# Altium project SoM.PrjPcb (part 4 of 4)

## Sheet [18] Power_Management.SchDoc: Power Management
size B; DocumentNumber: I; Revision: 01; SheetNumber: 18; SheetTotal: 19
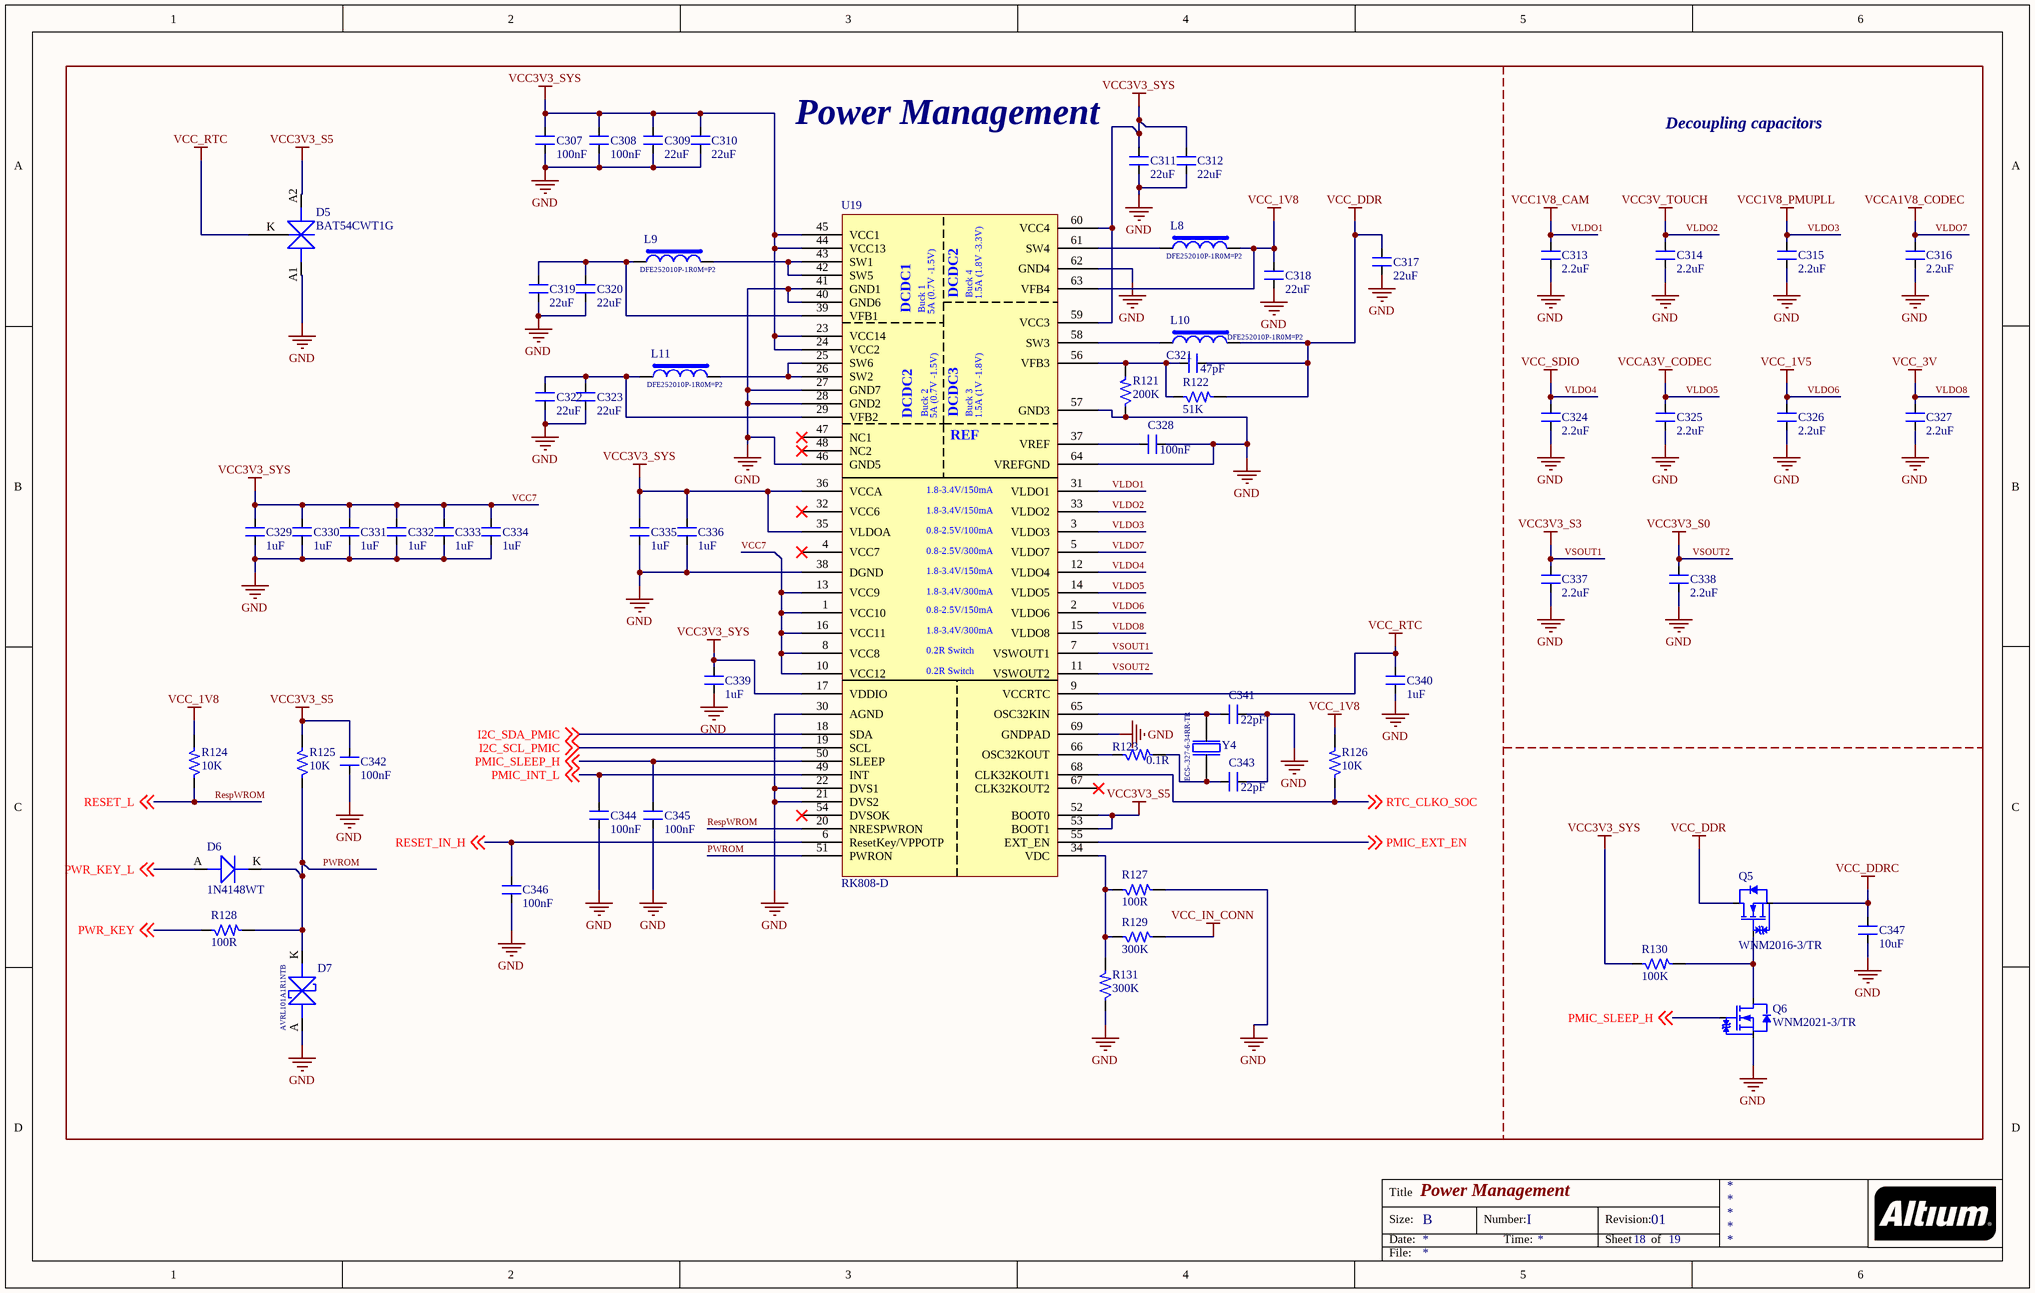
[diagram p17: [18] Power_Management.SchDoc]

### Parts
C307  100nF  [CAP_0402]
C308  100nF  [CAP_0402]
C309  22uF  [CAP_0603]
C310  22uF  [CAP_0603]
C311  22uF  [CAP_0603]
C312  22uF  [CAP_0603]
C313  2.2uF  [CAP_0402]
C314  2.2uF  [CAP_0402]
C315  2.2uF  [CAP_0402]
C316  2.2uF  [CAP_0402]
C317  22uF  [CAP_0603]
C318  22uF  [CAP_0603]
C319  22uF  [CAP_0603]
C320  22uF  [CAP_0603]
C321  47pF  [CAP_0402]
C322  22uF  [CAP_0603]
C323  22uF  [CAP_0603]
C324  2.2uF  [CAP_0402]
C325  2.2uF  [CAP_0402]
C326  2.2uF  [CAP_0402]
C327  2.2uF  [CAP_0402]
C328  100nF  [CAP_0402]
C329  1uF  [CAP_0402]
C330  1uF  [CAP_0402]
C331  1uF  [CAP_0402]
C332  1uF  [CAP_0402]
C333  1uF  [CAP_0402]
C334  1uF  [CAP_0402]
C335  1uF  [CAP_0402]
C336  1uF  [CAP_0402]
C337  2.2uF  [CAP_0402]
C338  2.2uF  [CAP_0402]
C339  1uF  [CAP_0402]
C340  1uF  [CAP_0402]
C341  22pF  [CAP_0402]
C342  100nF  [CAP_0402]
C343  22pF  [CAP_0402]
C344  100nF  [CAP_0402]
C345  100nF  [CAP_0402]
C346  100nF  [CAP_0402]
C347  10uF  [CAP_0402]
D5  BAT54CWT1G  [DIO_SOT-323-3]
D6  1N4148WT  [DIO_SOD523]
D7  AVRL101A1R1NTB  [DIO_0402_SMD]
L8  DFE252010P-1R0M=P2  [IND_1008]
L9  DFE252010P-1R0M=P2  [IND_1008]
L10  DFE252010P-1R0M=P2  [IND_1008]
L11  DFE252010P-1R0M=P2  [IND_1008]
Q5  WNM2016-3/TR  [SOT 23-3]
Q6  WNM2021-3/TR  [SOT-323-3]
R121  200K  [RES_0402]
R122  51K  [RES_0402]
R123  0.1R  [RES_0402]
R124  10K  [RES_0402]
R125  10K  [RES_0402]
R126  10K  [RES_0402]
R127  100R  [RES_0402]
R128  100R  [RES_0402]
R129  300K  [RES_0402]
R130  100K  [RES_0402]
R131  300K  [RES_0402]
U19  RK808-D  [QFN68_13.7_220.4X220.4_SMD]
Y4  ECS-.327-6-34RR-TR  [XTAL_ECS-.327-6-34RR-TR]

### Nets
GND: C307.1 C308.1 C309.1 C310.1 C311.1 C312.1 C313.1 C314.1 C315.1 C316.1 C317.1 C318.1 C319.1 C320.1 C322.1 C323.1 C324.1 C325.1 C326.1 C327.1 C328.2 C329.1 C330.1 C331.1 C332.1 C333.1 C334.1 C335.1 C336.1 C337.1 C338.1 C339.1 C340.1 C341.2 C342.1 C343.2 C344.1 C345.1 C346.1 C347.1 D5.A1 D7.A Q6.2(S) R121.1 R127.2 R131.1 U19.21(DVS2) U19.22(DVS1) U19.27(GND7) U19.28(GND2) U19.30(AGND) U19.38(DGND) U19.40(GND6) U19.41(GND1) U19.46(GND5) U19.57(GND3) U19.62(GND4) U19.64(VREFGND) U19.69(GNDPAD)
VCC3V3_S5: C342.2 D5.A2 R125.2 U19.52(BOOT0) U19.53(BOOT1)
VCC7: C307.2 C308.2 C309.2 C310.2 C311.2 C312.2 C329.2 C330.2 C331.2 C332.2 C333.2 C334.2 C335.2 C336.2 C339.2 R130.1 U19.1(VCC10) U19.8(VCC8) U19.10(VCC12) U19.13(VCC9) U19.16(VCC11) U19.17(VDDIO) U19.23(VCC14) U19.24(VCC2) U19.35(VLDOA) U19.36(VCCA) U19.44(VCC13) U19.45(VCC1) U19.59(VCC3) U19.60(VCC4)  [also labelled VCC3V3_SYS]
VCC_1V8: C318.2 L8.2 R124.2 R126.2 U19.63(VFB4)  [project net EDP_AVDD_1V8]
VCC_DDR: C317.2 C321.2 L10.2 Q5.3(D) R122.2
VCC_DDRC: C347.2 Q5.2(S)
VCC_IN_CONN: R129.2
VCC_RTC: C340.2 D5.K U19.9(VCCRTC)
VLDO1: C313.2 U19.31(VLDO1)  [also labelled VCC1V8_CAM]
VLDO2: C314.2 U19.33(VLDO2)  [also labelled VCC3V_TOUCH]
VLDO3: C315.2 U19.3(VLDO3)  [also labelled VCC1V8_PMUPLL]
VLDO4: C324.2 U19.12(VLDO4)  [also labelled VCC_SDIO]
VLDO5: C325.2 U19.14(VLDO5)  [also labelled VCCA3V_CODEC]
VLDO6: C326.2 U19.2(VLDO6)  [also labelled VCC_1V5]
VLDO7: C316.2 U19.5(VLDO7)  [also labelled VCCA1V8_CODEC]
VLDO8: C327.2 U19.15(VLDO8)  [also labelled VCC_3V]
VSOUT1: C337.2 U19.7(VSWOUT1)  [also labelled VCC3V3_S3]
VSOUT2: C338.2 U19.11(VSWOUT2)  [also labelled VCC3V3_S0]
I2C_SCL_PMIC: U19.19(SCL) ; off-sheet I2C_SCL_PMIC
I2C_SDA_PMIC: U19.18(SDA) ; off-sheet I2C_SDA_PMIC
PMIC_EXT_EN: U19.55(EXT_EN) ; off-sheet PMIC_EXT_EN
PMIC_INT_L: C344.2 U19.49(INT) ; off-sheet PMIC_INT_L
PMIC_SLEEP_H: C345.2 Q6.1(G) U19.50(SLEEP) ; off-sheet PMIC_SLEEP_H
PWR_KEY: R128.1 ; off-sheet PWR_KEY
PWR_KEY_L: D6.A(ANODE) ; off-sheet PWR_KEY_L
PWROM: D6.K(CATHODE) D7.K R125.1 R128.2 U19.51(PWRON)
RESET_IN_H: C346.2 U19.6(ResetKey/VPPOTP) ; off-sheet RESET_IN_H
RespWROM: R124.1 U19.20(NRESPWRON) ; off-sheet RESET_L  [also labelled RESET_L]
RTC_CLKO_SOC: R126.1 U19.68(CLK32KOUT1) ; off-sheet RTC_CLKO_SOC
NetC319_2: C319.2 C320.2 L9.1 U19.39(VFB1)
NetC321_1: C321.1 R121.2 R122.1 U19.56(VFB3)
NetC322_2: C322.2 C323.2 L11.1 U19.29(VFB2)
NetC328_1: C328.1 U19.37(VREF)
NetC341_1: C341.1 U19.65(OSC32KIN) Y4.2
NetC343_1: C343.1 R123.2 Y4.1
NetL8_1: L8.1 U19.61(SW4)
NetL9_2: L9.2 U19.42(SW5) U19.43(SW1)
NetL10_1: L10.1 U19.58(SW3)
NetL11_2: L11.2 U19.25(SW6) U19.26(SW2)
NetQ5_1: Q5.1(G) Q6.3(D) R130.2
NetR123_1: R123.1 U19.66(OSC32KOUT)
NetR127_1: R127.1 R129.1 R131.2 U19.34(VDC)

Not connected (* = marked no-connect by the designer): U19 4(VCC7)* 32(VCC6)* 47(NC1)* 48(NC2)* 54(DVSOK)* 67(CLK32KOUT2)*

### Notes on the sheet
- Power Management
- Decoupling capacitors
- Title
- Size:
- Date:
- B
- Number:
- Time:
- Revision:
- Sheet
- of
- File:
- (in symbol IC_RK808-D-QFN68) DCDC2; Buck 4; 1.5A (1.8V -3.3V); DCDC1; Buck 1; 5A (0.7V -1.5V); Buck 2; DCDC3; Buck 3; 1.5A (1V -1.8V); REF; 1.8-3.4V/150mA; 0.8-2.5V/100mA; 0.8-2.5V/300mA; 1.8-3.4V/300mA; 0.8-2.5V/150mA; 0.2R Switch

### Library data of the parts
C307 C308 = CAP_100nF-25V-10%-0402: 0.1µF ±10% 25V Ceramic Capacitor X7R 0402 (1005 Metric) /; Manufacturer: Walsin Technology Corporation; Manufacturer Part Number: 0402B104K250CT; Case/Package: 0402; Supplier-1: Digikey
C309-C312 C317-C320 C322 C323 = CAP_22uF-10V-20%-0603: 22µF ±20% 10V Ceramic Capacitor X5R 0603 (1608 Metric) /; Manufacturer: Murata Electronics; Manufacturer Part Number: GRM188R61A226ME15D; Case/Package: 0603; Supplier-1: Digikey
C313-C316 C324-C327 C337 C338 = CAP_2.2uF-10V-10%-0402: 2.2µF ±10% 10V Ceramic Capacitor X5R 0402 (1005 Metric) /; Manufacturer: Murata Electronics; Manufacturer Part Number: GRM155R61A225KE95D; Case/Package: 0402; Supplier-1: Digikey
C321 = CAP_47pF-10V-10%-0402: 47pF ±10% 10V Ceramic Capacitor C0G, NP0 0402 (1005 Metric) /; Manufacturer: KEMET; Manufacturer Part Number: C0402C470K8GAC7867; Case/Package: 0402; Supplier-1: Supplier-1
C328 C342 C344-C346 = CAP_100nF-10V-10%-0402: 0.1µF ±10% 10V Ceramic Capacitor X7R 0402 (1005 Metric) /; Manufacturer: Yageo; Manufacturer Part Number: CC0402KRX7R6BB104; Case/Package: 0402; Supplier-1: Digikey
C329-C336 C339 = CAP_1uF-10V-10%-0402: 1µF ±10% 10V Ceramic Capacitor X6S 0402 (1005 Metric) /; Manufacturer: Murata Electronics; Manufacturer Part Number: GRT155C81A105KE01D; Case/Package: 0402; Supplier-1: Digikey
C340 = CAP_1uF-16V-10%-0402: 1µF ±10% 16V Ceramic Capacitor X5R 0402 (1005 Metric) /; Manufacturer: Knowles Novacap; Manufacturer Part Number: 0402BW105K160YT; Case/Package: 0402; Supplier-1: Digikey
C341 C343 = CAP_22pF-10V-10%-0402: 22pF ±10% 10V Ceramic Capacitor C0G, NP0 0402 (1005 Metric) /; Manufacturer: KEMET; Manufacturer Part Number: C0402C220K8GACTU; Case/Package: 0402; Supplier-1: Digikey
C347 = CAP_10uF-10V-20%-0402: 10µF ±20% 10V Ceramic Capacitor X5R 0402 (1005 Metric) /; Manufacturer Part Number: CL05A106MP5NUNC; Manufacturer: Samsung Electro-Mechanics; Case/Package: 0402; Supplier-1: Digikey
D5 = DIO-S-A_30V-200mA-SOT-323: Diode Array 1 Pair Common Cathode Schottky 30V 200mA (DC) Surface Mount SC-70, SOT-323; Manufacturer: ON Semiconductor; Manufacturer Part Number: BAT54CWT1G; Case/Package: SOT323; Supplier-1: Digikey
D6 = DIO_75V-200mA-SOD-523F: Diode Standard 100V 300mA (DC) Surface Mount SOD-123; Manufacturer: FAIRCHILD; Manufacturer Part Number: 1N4148WT; Case/Package: SOD123; Supplier-1: SIRICOM
D7 = DIO-T_10V-39V-0402: 39V Varistor 1 Circuit Surface Mount, MLCV 0402 (1005 Metric); Manufacturer: TDK Corporation; Manufacturer Part Number: AVRL101A1R1NTB; Supplier-1: Digikey; Case/Package: 0402
L8-L11 = IND_1uH-3.8A-20%-1008: 1µH Shielded Wirewound Inductor 3.8A 54mOhm Max 1008 (2520 Metric) /; Manufacturer: Murata Electronics; Manufacturer Part Number: DFE252010P-1R0M=P2; Case/Package: 1008; Supplier-1: Digikey
Q5 = MOSFET-N_20V-2.9A-SOT-23: N Channel 20V 2.9A 1V @ 250uA 47mΩ @ 3.6A,4.5V 700mW SOT-23(SOT-23-3) MOSFET RoHS /; Manufacturer: WILLSEMI(Will Semicon); Manufacturer Part Number: WNM2016-3/TR; Case/Package: SOT-23(SOT-23-3); Supplier-1: LCSC
Q6 = MOSFET-N_20V-820mA-SOT-323: N Channel 20V 820mA 850mV @ 250uA 310mΩ @ 550mA,4.5V 310mW SOT-323(SC-70) MOSFET RoHS /; Manufacturer: WILLSEMI(Will Semicon); Manufacturer Part Number: WNM2021-3/TR; Case/Package: SOT-323(SC-70); Supplier-1: LCSC
R121 = RES_200K-0.1W-1%-0402: 200 kOhms ±1% 0.1W, 1/10W Chip Resistor 0402 (1005 Metric) Automotive AEC-Q200 Thick Film /; Manufacturer: Panasonic Electronic Components; Manufacturer Part number: ERJ-2RKF2003X; Case/Package: 0402; Supplier-1: Digikey
R122 = RES_51K-0.1W-1%-0402: 51 kOhms ±1% 0.1W, 1/10W Chip Resistor 0402 (1005 Metric) Automotive AEC-Q200 Thick Film /; Manufacturer: Panasonic Electronic Components; Manufacturer Part Number: ERJ-2RKF5102X; Case/Package: 0402; Supplier-1: Digikey
R123 = RES_0.1R-0.1W-1%-0402: 100 mOhms ±1% 0.1W, 1/10W Chip Resistor 0402 (1005 Metric) Current Sense, Moisture Resistant Thick Film /; Manufacturer: Samsung Electro-Mechanics; Manufacturer Part Number: RUT1005FR100CS; Casse/Package: 0402; Supplier-1: Digikey
R124-R126 = RES_10K-0.1W-1%-0402: 10 kOhms ±1% 0.1W, 1/10W Chip Resistor 0402 (1005 Metric) Anti-Sulfur Thin Film /; Manufacturer: Vishay Beyschlag/Draloric/BC Components; Manufacturer Part Number: MCS04020C1002FE000; Case/Package: 0402; Supplier-1: Digikey
R127 R128 = RES_100R-0.1W-1%-0402: 100 Ohms ±1% 0.1W, 1/10W Chip Resistor 0402 (1005 Metric) Automotive AEC-Q200, Moisture Resistant Thick Film /; Manufacturer: KOA Speer Electronics, Inc.; Manufacturer Part Number: RK73H1ETTP1000F; Case/Package: 0402; Supplier-1: Digikey
R129 R131 = RES_300K-0.1W-1%-0402: 300 kOhms ±1% 0.1W, 1/10W Chip Resistor 0402 (1005 Metric) Automotive AEC-Q200 Thick Film /; Manufacturer: Panasonic Electronic Components; Manufacturer Part Number: ERJ-2RKF3003X; Case/Package: 0402; Supplier-1: Digikey
R130 = RES_100K-0.1W-1%-0402: 100 kOhms ±1% 0.1W, 1/10W Chip Resistor 0402 (1005 Metric) Anti-Sulfur Thin Film /; Manufacturer: Vishay Beyschlag/Draloric/BC Components; Manufacturer Part Number: MCS04020C1003FE000; Case/Package: 0402; Supplier-1: Digikey
U19 = IC_RK808-D-QFN68: The RK808 is a complete power supply solution for Portable systems.; Manufacturer: Rockchip; Manufacturer Part Number: RK808-D; Case/Package: QFN68; Supplier-1: Rockchip
Y4 = XTAL_32.768Khz-22pF-SMD: 32.768kHz ±20ppm Crystal 12pF 80 kOhms 2-SMD, No Lead /; Manufacturer: Ecliptek; Manufacturer Part Number: ECS-.327-6-34RR-TR; Case/Package: 0603; Supplier-1: Digikey

## Sheet [19] RAM Memory module.SchDoc: RAM Memory
size B; DocumentNumber: I; Revision: 01; SheetNumber: 19; SheetTotal: 19
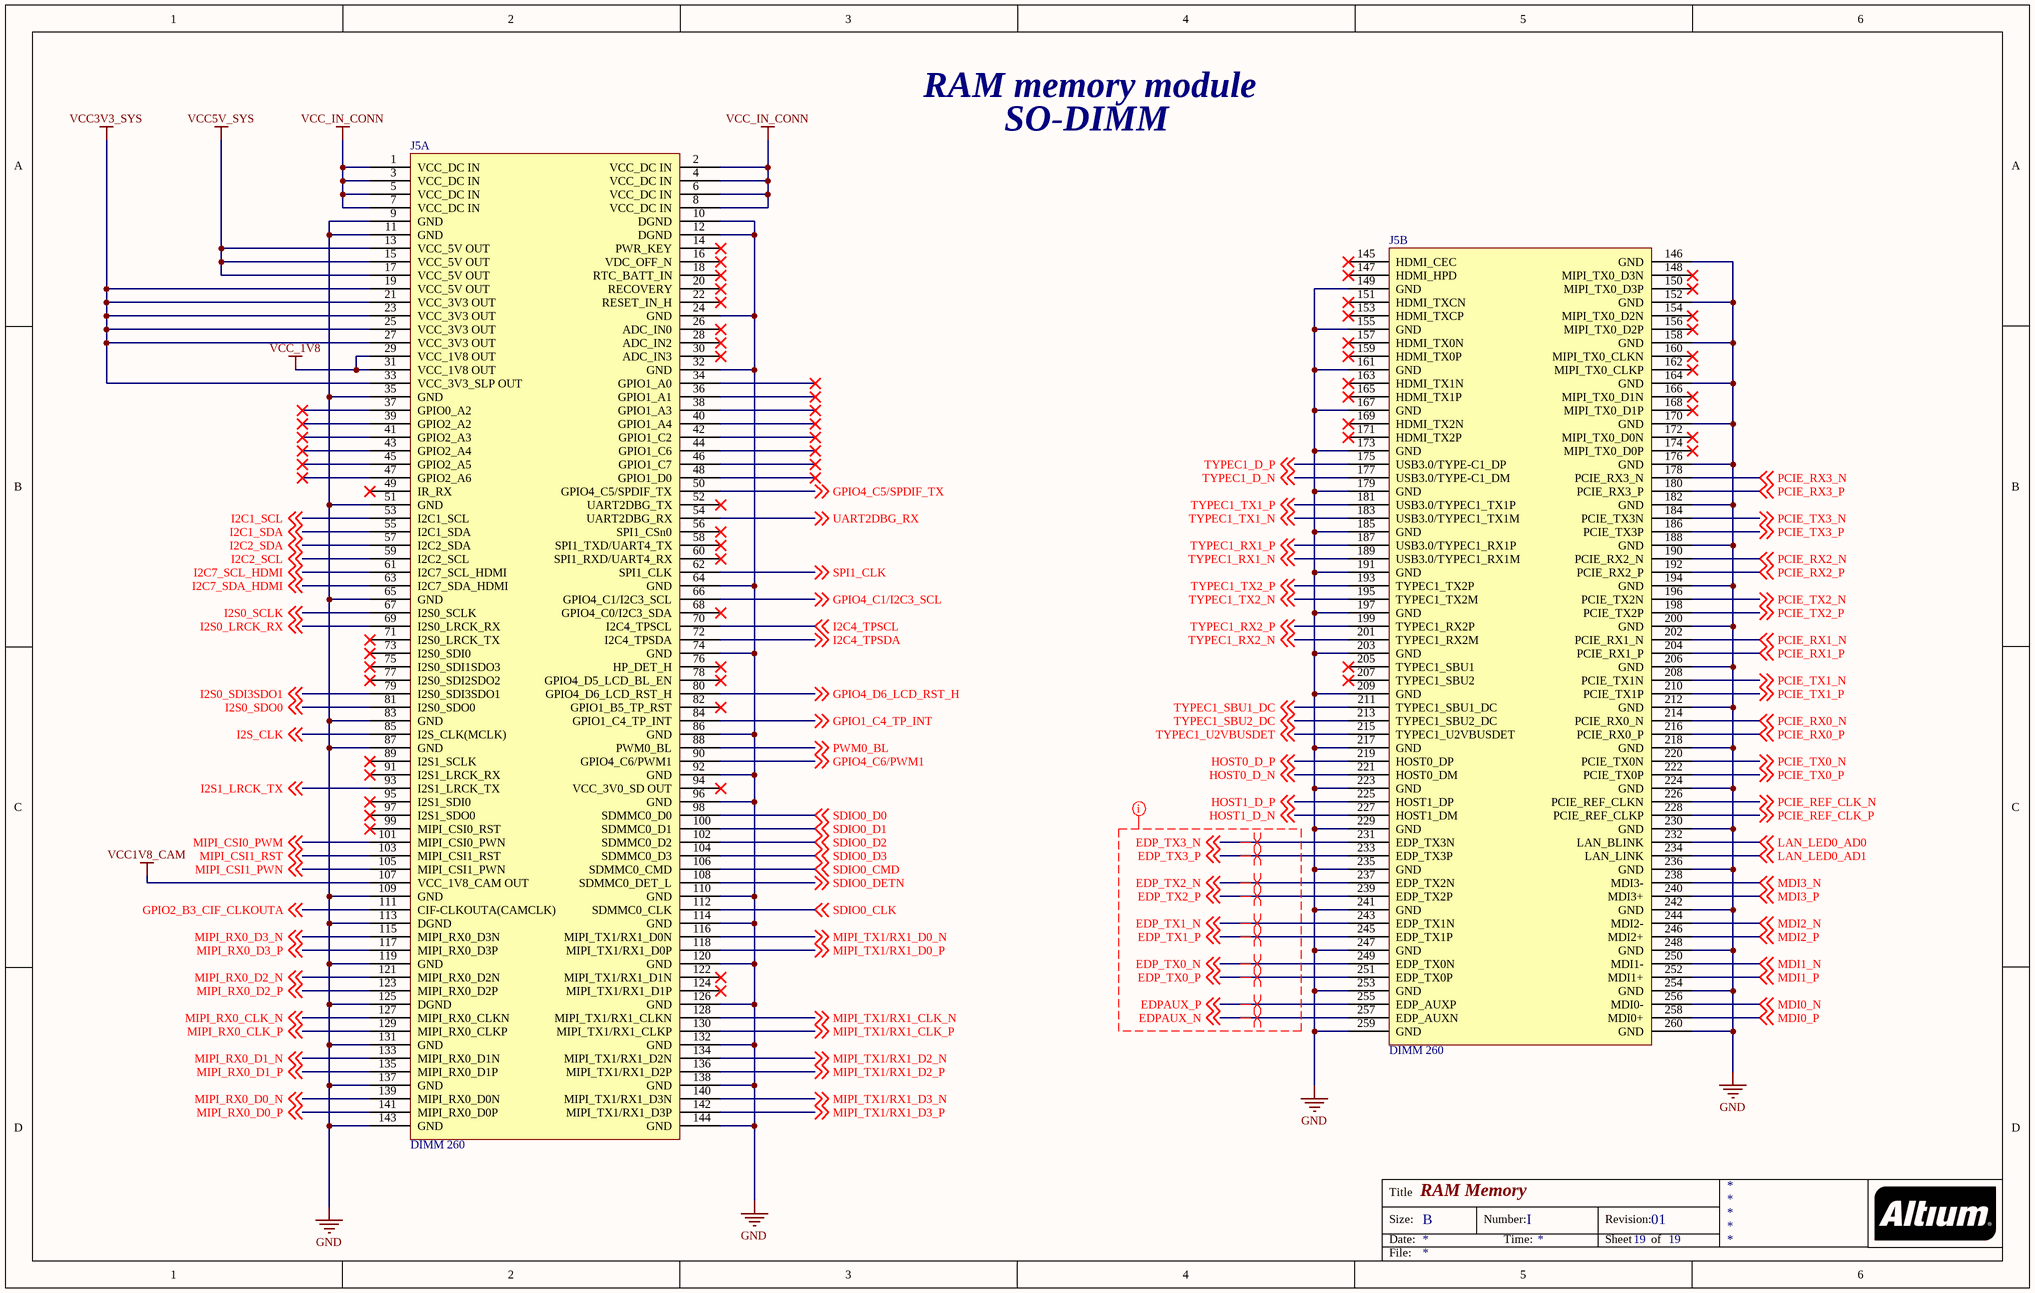
[diagram p18: [19] RAM Memory module.SchDoc]

### Parts
J5  DIMM 260  [DIMM260_DDR4]  (parts A,B of 2)

### Nets
GND: J5.9(GND) J5.10(DGND) J5.11(GND) J5.12(DGND) J5.24(GND) J5.32(GND) J5.35(GND) J5.51(GND) J5.64(GND) J5.65(GND) J5.74(GND) J5.83(GND) J5.86(GND) J5.87(GND) J5.92(GND) J5.96(GND) J5.109(GND) J5.110(GND) J5.113(DGND) J5.114(GND) J5.119(GND) J5.120(GND) J5.125(DGND) J5.126(GND) J5.131(GND) J5.132(GND) J5.137(GND) J5.138(GND) J5.143(GND) J5.144(GND) J5.146(GND) J5.149(GND) J5.152(GND) J5.155(GND) J5.158(GND) J5.161(GND) J5.164(GND) J5.167(GND) J5.170(GND) J5.173(GND) J5.176(GND) J5.179(GND) J5.182(GND) J5.185(GND) J5.188(GND) J5.191(GND) J5.194(GND) J5.197(GND) J5.200(GND) J5.203(GND) J5.206(GND) J5.209(GND) J5.212(GND) J5.217(GND) J5.218(GND) J5.223(GND) J5.224(GND) J5.229(GND) J5.230(GND) J5.235(GND) J5.236(GND) J5.241(GND) J5.242(GND) J5.247(GND) J5.248(GND) J5.253(GND) J5.254(GND) J5.259(GND) J5.260(GND)
VCC1V8_CAM: J5.107(VCC_1V8_CAM_OUT)  [project net VLDO1]
VCC3V3_SYS: J5.19(VCC_5V_OUT) J5.21(VCC_3V3_OUT) J5.23(VCC_3V3_OUT) J5.25(VCC_3V3_OUT) J5.27(VCC_3V3_OUT) J5.33(VCC_3V3_SLP_OUT)  [project net VCC7]
VCC5V_SYS: J5.13(VCC_5V_OUT) J5.15(VCC_5V_OUT) J5.17(VCC_5V_OUT)
VCC_1V8: J5.29(VCC_1V8_OUT) J5.31(VCC_1V8_OUT)  [project net EDP_AVDD_1V8]
VCC_IN_CONN: J5.1(VCC_DC_IN) J5.2(VCC_DC_IN) J5.3(VCC_DC_IN) J5.4(VCC_DC_IN) J5.5(VCC_DC_IN) J5.6(VCC_DC_IN) J5.7(VCC_DC_IN) J5.8(VCC_DC_IN)
EDP_TX0_N: J5.249(EDP_TX0N) ; off-sheet EDP_TX0_N
EDP_TX0_P: J5.251(EDP_TX0P) ; off-sheet EDP_TX0_P
EDP_TX1_N: J5.243(EDP_TX1N) ; off-sheet EDP_TX1_N
EDP_TX1_P: J5.245(EDP_TX1P) ; off-sheet EDP_TX1_P
EDP_TX2_N: J5.237(EDP_TX2N) ; off-sheet EDP_TX2_N
EDP_TX2_P: J5.239(EDP_TX2P) ; off-sheet EDP_TX2_P
EDP_TX3_N: J5.231(EDP_TX3N) ; off-sheet EDP_TX3_N
EDP_TX3_P: J5.233(EDP_TX3P) ; off-sheet EDP_TX3_P
EDPAUX_N: J5.257(EDP_AUXN) ; off-sheet EDPAUX_N
EDPAUX_P: J5.255(EDP_AUXP) ; off-sheet EDPAUX_P
GPIO1_C4_TP_INT: J5.84(GPIO1_C4_TP_INT) ; off-sheet GPIO1_C4_TP_INT
GPIO2_B3_CIF_CLKOUTA: J5.111(CIF-CLKOUTA(CAMCLK)) ; off-sheet GPIO2_B3_CIF_CLKOUTA
GPIO4_C1/I2C3_SCL: J5.66(GPIO4_C1/I2C3_SCL) ; off-sheet GPIO4_C1/I2C3_SCL
GPIO4_C5/SPDIF_TX: J5.50(GPIO4_C5/SPDIF_TX) ; off-sheet GPIO4_C5/SPDIF_TX
GPIO4_C6/PWM1: J5.90(GPIO4_C6/PWM1) ; off-sheet GPIO4_C6/PWM1
GPIO4_D6_LCD_RST_H: J5.80(GPIO4_D6_LCD_RST_H) ; off-sheet GPIO4_D6_LCD_RST_H
HOST0_D_N: J5.221(HOST0_DM) ; off-sheet HOST0_D_N
HOST0_D_P: J5.219(HOST0_DP) ; off-sheet HOST0_D_P
HOST1_D_N: J5.227(HOST1_DM) ; off-sheet HOST1_D_N
HOST1_D_P: J5.225(HOST1_DP) ; off-sheet HOST1_D_P
I2C1_SCL: J5.53(I2C1_SCL) ; off-sheet I2C1_SCL
I2C1_SDA: J5.55(I2C1_SDA) ; off-sheet I2C1_SDA
I2C2_SCL: J5.59(I2C2_SCL) ; off-sheet I2C2_SCL
I2C2_SDA: J5.57(I2C2_SDA) ; off-sheet I2C2_SDA
I2C4_TPSCL: J5.70(I2C4_TPSCL) ; off-sheet I2C4_TPSCL
I2C4_TPSDA: J5.72(I2C4_TPSDA) ; off-sheet I2C4_TPSDA
I2C7_SCL_HDMI: J5.61(I2C7_SCL_HDMI) ; off-sheet I2C7_SCL_HDMI
I2C7_SDA_HDMI: J5.63(I2C7_SDA_HDMI) ; off-sheet I2C7_SDA_HDMI
I2S0_LRCK_RX: J5.69(I2S0_LRCK_RX) ; off-sheet I2S0_LRCK_RX
I2S0_SCLK: J5.67(I2S0_SCLK) ; off-sheet I2S0_SCLK
I2S0_SDI3SDO1: J5.79(I2S0_SDI3SDO1) ; off-sheet I2S0_SDI3SDO1
I2S0_SDO0: J5.81(I2S0_SDO0) ; off-sheet I2S0_SDO0
I2S1_LRCK_TX: J5.93(I2S1_LRCK_TX) ; off-sheet I2S1_LRCK_TX
I2S_CLK: J5.85(I2S_CLK(MCLK)) ; off-sheet I2S_CLK
LAN_LED0_AD0: J5.232(LAN_BLINK) ; off-sheet LAN_LED0_AD0
LAN_LED0_AD1: J5.234(LAN_LINK) ; off-sheet LAN_LED0_AD1
MDI0_N: J5.256(MDI0-) ; off-sheet MDI0_N
MDI0_P: J5.258(MDI0+) ; off-sheet MDI0_P
MDI1_N: J5.250(MDI1-) ; off-sheet MDI1_N
MDI1_P: J5.252(MDI1+) ; off-sheet MDI1_P
MDI2_N: J5.244(MDI2-) ; off-sheet MDI2_N
MDI2_P: J5.246(MDI2+) ; off-sheet MDI2_P
MDI3_N: J5.238(MDI3-) ; off-sheet MDI3_N
MDI3_P: J5.240(MDI3+) ; off-sheet MDI3_P
MIPI_CSI0_PWM: J5.101(MIPI_CSI0_PWN) ; off-sheet MIPI_CSI0_PWM
MIPI_CSI1_PWN: J5.105(MIPI_CSI1_PWN) ; off-sheet MIPI_CSI1_PWN
MIPI_CSI1_RST: J5.103(MIPI_CSI1_RST) ; off-sheet MIPI_CSI1_RST
MIPI_RX0_CLK_N: J5.127(MIPI_RX0_CLKN) ; off-sheet MIPI_RX0_CLK_N
MIPI_RX0_CLK_P: J5.129(MIPI_RX0_CLKP) ; off-sheet MIPI_RX0_CLK_P
MIPI_RX0_D0_N: J5.139(MIPI_RX0_D0N) ; off-sheet MIPI_RX0_D0_N
MIPI_RX0_D0_P: J5.141(MIPI_RX0_D0P) ; off-sheet MIPI_RX0_D0_P
MIPI_RX0_D1_N: J5.133(MIPI_RX0_D1N) ; off-sheet MIPI_RX0_D1_N
MIPI_RX0_D1_P: J5.135(MIPI_RX0_D1P) ; off-sheet MIPI_RX0_D1_P
MIPI_RX0_D2_N: J5.121(MIPI_RX0_D2N) ; off-sheet MIPI_RX0_D2_N
MIPI_RX0_D2_P: J5.123(MIPI_RX0_D2P) ; off-sheet MIPI_RX0_D2_P
MIPI_RX0_D3_N: J5.115(MIPI_RX0_D3N) ; off-sheet MIPI_RX0_D3_N
MIPI_RX0_D3_P: J5.117(MIPI_RX0_D3P) ; off-sheet MIPI_RX0_D3_P
MIPI_TX1/RX1_CLK_N: J5.128(MIPI_TX1/RX1_CLKN) ; off-sheet MIPI_TX1/RX1_CLK_N
MIPI_TX1/RX1_CLK_P: J5.130(MIPI_TX1/RX1_CLKP) ; off-sheet MIPI_TX1/RX1_CLK_P
MIPI_TX1/RX1_D0_N: J5.116(MIPI_TX1/RX1_D0N) ; off-sheet MIPI_TX1/RX1_D0_N
MIPI_TX1/RX1_D0_P: J5.118(MIPI_TX1/RX1_D0P) ; off-sheet MIPI_TX1/RX1_D0_P
MIPI_TX1/RX1_D2_N: J5.134(MIPI_TX1/RX1_D2N) ; off-sheet MIPI_TX1/RX1_D2_N
MIPI_TX1/RX1_D2_P: J5.136(MIPI_TX1/RX1_D2P) ; off-sheet MIPI_TX1/RX1_D2_P
MIPI_TX1/RX1_D3_N: J5.140(MIPI_TX1/RX1_D3N) ; off-sheet MIPI_TX1/RX1_D3_N
MIPI_TX1/RX1_D3_P: J5.142(MIPI_TX1/RX1_D3P) ; off-sheet MIPI_TX1/RX1_D3_P
PCIE_REF_CLK_N: J5.226(PCIE_REF_CLKN) ; off-sheet PCIE_REF_CLK_N
PCIE_REF_CLK_P: J5.228(PCIE_REF_CLKP) ; off-sheet PCIE_REF_CLK_P
PCIE_RX0_N: J5.214(PCIE_RX0_N) ; off-sheet PCIE_RX0_N
PCIE_RX0_P: J5.216(PCIE_RX0_P) ; off-sheet PCIE_RX0_P
PCIE_RX1_N: J5.202(PCIE_RX1_N) ; off-sheet PCIE_RX1_N
PCIE_RX1_P: J5.204(PCIE_RX1_P) ; off-sheet PCIE_RX1_P
PCIE_RX2_N: J5.190(PCIE_RX2_N) ; off-sheet PCIE_RX2_N
PCIE_RX2_P: J5.192(PCIE_RX2_P) ; off-sheet PCIE_RX2_P
PCIE_RX3_N: J5.178(PCIE_RX3_N) ; off-sheet PCIE_RX3_N
PCIE_RX3_P: J5.180(PCIE_RX3_P) ; off-sheet PCIE_RX3_P
PCIE_TX0_N: J5.220(PCIE_TX0N) ; off-sheet PCIE_TX0_N
PCIE_TX0_P: J5.222(PCIE_TX0P) ; off-sheet PCIE_TX0_P
PCIE_TX1_N: J5.208(PCIE_TX1N) ; off-sheet PCIE_TX1_N
PCIE_TX1_P: J5.210(PCIE_TX1P) ; off-sheet PCIE_TX1_P
PCIE_TX2_N: J5.196(PCIE_TX2N) ; off-sheet PCIE_TX2_N
PCIE_TX2_P: J5.198(PCIE_TX2P) ; off-sheet PCIE_TX2_P
PCIE_TX3_N: J5.184(PCIE_TX3N) ; off-sheet PCIE_TX3_N
PCIE_TX3_P: J5.186(PCIE_TX3P) ; off-sheet PCIE_TX3_P
PWM0_BL: J5.88(PWM0_BL) ; off-sheet PWM0_BL
SDIO0_CLK: J5.112(SDMMC0_CLK) ; off-sheet SDIO0_CLK
SDIO0_CMD: J5.106(SDMMC0_CMD) ; off-sheet SDIO0_CMD
SDIO0_D0: J5.98(SDMMC0_D0) ; off-sheet SDIO0_D0
SDIO0_D1: J5.100(SDMMC0_D1) ; off-sheet SDIO0_D1
SDIO0_D2: J5.102(SDMMC0_D2) ; off-sheet SDIO0_D2
SDIO0_D3: J5.104(SDMMC0_D3) ; off-sheet SDIO0_D3
SDIO0_DETN: J5.108(SDMMC0_DET_L) ; off-sheet SDIO0_DETN
SPI1_CLK: J5.62(SPI1_CLK) ; off-sheet SPI1_CLK
TYPEC1_D_N: J5.177(USB3.0/TYPE-C1_DM) ; off-sheet TYPEC1_D_N
TYPEC1_D_P: J5.175(USB3.0/TYPE-C1_DP) ; off-sheet TYPEC1_D_P
TYPEC1_RX1_N: J5.189(USB3.0/TYPEC1_RX1M) ; off-sheet TYPEC1_RX1_N
TYPEC1_RX1_P: J5.187(USB3.0/TYPEC1_RX1P) ; off-sheet TYPEC1_RX1_P
TYPEC1_RX2_N: J5.201(TYPEC1_RX2M) ; off-sheet TYPEC1_RX2_N
TYPEC1_RX2_P: J5.199(TYPEC1_RX2P) ; off-sheet TYPEC1_RX2_P
TYPEC1_SBU1_DC: J5.211(TYPEC1_SBU1_DC) ; off-sheet TYPEC1_SBU1_DC
TYPEC1_SBU2_DC: J5.213(TYPEC1_SBU2_DC) ; off-sheet TYPEC1_SBU2_DC
TYPEC1_TX1_N: J5.183(USB3.0/TYPEC1_TX1M) ; off-sheet TYPEC1_TX1_N
TYPEC1_TX1_P: J5.181(USB3.0/TYPEC1_TX1P) ; off-sheet TYPEC1_TX1_P
TYPEC1_TX2_N: J5.195(TYPEC1_TX2M) ; off-sheet TYPEC1_TX2_N
TYPEC1_TX2_P: J5.193(TYPEC1_TX2P) ; off-sheet TYPEC1_TX2_P
TYPEC1_U2VBUSDET: J5.215(TYPEC1_U2VBUSDET) ; off-sheet TYPEC1_U2VBUSDET
UART2DBG_RX: J5.54(UART2DBG_RX) ; off-sheet UART2DBG_RX

Not connected (* = marked no-connect by the designer): J5 14(PWR_KEY)* 16(VDC_OFF_N)* 18(RTC_BATT_IN)* 20(RECOVERY)* 22(RESET_IN_H)* 26(ADC_IN0)* 28(ADC_IN2)* 30(ADC_IN3)* 34(GPIO1_A0)* 36(GPIO1_A1)* 37(GPIO0_A2)* 38(GPIO1_A3)* 39(GPIO2_A2)* 40(GPIO1_A4)* 41(GPIO2_A3)* 42(GPIO1_C2)* 43(GPIO2_A4)* 44(GPIO1_C6)* 45(GPIO2_A5)* 46(GPIO1_C7)* 47(GPIO2_A6)* 48(GPIO1_D0)* 49(IR_RX)* 52(UART2DBG_TX)* 56(SPI1_CSn0)* 58(SPI1_TXD/UART4_TX)* 60(SPI1_RXD/UART4_RX)* 68(GPIO4_C0/I2C3_SDA)* 71(I2S0_LRCK_TX)* 73(I2S0_SDI0)* 75(I2S0_SDI1SDO3)* 76(HP_DET_H)* 77(I2S0_SDI2SDO2)* 78(GPIO4_D5_LCD_BL_EN)* 82(GPIO1_B5_TP_RST)* 89(I2S1_SCLK)* 91(I2S1_LRCK_RX)* 94(VCC_3V0_SD_OUT)* 95(I2S1_SDI0)* 97(I2S1_SDO0)* 99(MIPI_CSI0_RST)* 122(MIPI_TX1/RX1_D1N)* 124(MIPI_TX1/RX1_D1P)* 145(HDMI_CEC)* 147(HDMI_HPD)* 148(MIPI_TX0_D3N)* 150(MIPI_TX0_D3P)* 151(HDMI_TXCN)* 153(HDMI_TXCP)* 154(MIPI_TX0_D2N)* 156(MIPI_TX0_D2P)* 157(HDMI_TX0N)* 159(HDMI_TX0P)* 160(MIPI_TX0_CLKN)* 162(MIPI_TX0_CLKP)* 163(HDMI_TX1N)* 165(HDMI_TX1P)* 166(MIPI_TX0_D1N)* 168(MIPI_TX0_D1P)* 169(HDMI_TX2N)* 171(HDMI_TX2P)* 172(MIPI_TX0_D0N)* 174(MIPI_TX0_D0P)* 205(TYPEC1_SBU1)* 207(TYPEC1_SBU2)*

### Layout directives
mark named 100_OHM_DIFF: EDP_TX0_N, EDP_TX0_P, EDP_TX1_N, EDP_TX1_P, EDP_TX2_N, EDP_TX2_P, EDP_TX3_N, EDP_TX3_P, EDPAUX_N, EDPAUX_P
differential pair; differential pair class 100_OHM_DIFF: EDP_TX0_N, EDP_TX0_P, EDP_TX1_N, EDP_TX1_P, EDP_TX2_N, EDP_TX2_P, EDP_TX3_N, EDP_TX3_P, EDPAUX_N, EDPAUX_P

### Notes on the sheet
- RAM memory module
- SO-DIMM
- Title
- Size:
- Date:
- B
- Number:
- Time:
- Revision:
- Sheet
- of
- File:

### Library data of the parts
J5 = CON-DIMM_260-SMD: Dimm 260 pin smd plating on pcb; Manufacturer: NA; Manufacturer Part Number: NA; Case/Package: NA; Supplier-1: NA

## Nets that join several sheets
EDP_AVDD_0V9: [2] RK3399_SDRAM (FB3.2), [3] RK3399_PMU (FB8.1 U8.T24), [4] RK3399_EMMC_ADC_PCIE (C187.2 C192.2 U8.L24 U8.W24), [5] RK3399_EDP_CSI_HDMI (6 pins), [6] RK3399_USB2_USIC (8 pins), [17] Voltage_Regulators (C305.2 L7.2 R112.2)
EDP_AVDD_1V8: [11] FlashMemory (9 pins), [3] RK3399_PMU (FB7.2 FB9.1), [4] RK3399_EMMC_ADC_PCIE (5 pins), [5] RK3399_EDP_CSI_HDMI (8 pins), [6] RK3399_USB2_USIC (6 pins), [7] RK3399_MIPI-CSI_I2C (12 pins), [8] RK3399_SDIO_SPI_GPIOs (C225.2 C227.2 U8.AB8 U8.J22), [17] Voltage_Regulators (R105.2 R106.2 R109.1), [18] Power_Management (5 pins), [19] RAM Memory module (J5.29 J5.31)
GND: [9] LPDDR4_SDRAM1 (100 pins), [10] LPDDR_SDRAM2 (104 pins), [11] FlashMemory (18 pins), [12] WIFI_Module (29 pins), [1] RK3399_PowerPins (268 pins), [2] RK3399_SDRAM (19 pins), [3] RK3399_PMU (14 pins), [4] RK3399_EMMC_ADC_PCIE (9 pins), [5] RK3399_EDP_CSI_HDMI (18 pins), [6] RK3399_USB2_USIC (16 pins), [7] RK3399_MIPI-CSI_I2C (6 pins), [8] RK3399_SDIO_SPI_GPIOs (11 pins), [13] TYPEC0_PROG (25 pins), [14] Ethernet (29 pins), [15] PushButtons (Q1.2 SW2.1 SW3.1), [16] SPI_TYPEC_PWR (34 pins), [17] Voltage_Regulators (45 pins), [18] Power_Management (59 pins), [19] RAM Memory module (69 pins)
VCC3V3_S5: [16] SPI_TYPEC_PWR (C281.2 C282.2 C283.2 U14.5), [18] Power_Management (5 pins)
VCC5V_SYS: [12] WIFI_Module (C96.1 U4.1 U4.6), [13] TYPEC0_PROG (5 pins), [15] PushButtons (R92.2), [16] SPI_TYPEC_PWR (8 pins), [19] RAM Memory module (J5.13 J5.15 J5.17)
VCC7: [12] WIFI_Module (5 pins), [3] RK3399_PMU (C185.2 U9.1), [13] TYPEC0_PROG (C234.2 U10.4), [15] PushButtons (SW1.1), [16] SPI_TYPEC_PWR (5 pins), [17] Voltage_Regulators (21 pins), [18] Power_Management (30 pins), [19] RAM Memory module (6 pins)
VCC_DDR: [9] LPDDR4_SDRAM1 (43 pins), [10] LPDDR_SDRAM2 (43 pins), [2] RK3399_SDRAM (44 pins), [18] Power_Management (5 pins)
VCC_DDRC: [9] LPDDR4_SDRAM1 (41 pins), [10] LPDDR_SDRAM2 (41 pins), [18] Power_Management (C347.2 Q5.2)
VCC_IN_CONN: [16] SPI_TYPEC_PWR (10 pins), [18] Power_Management (R129.2), [19] RAM Memory module (8 pins)
VLDO1: [18] Power_Management (C313.2 U19.31), [19] RAM Memory module (J5.107)
VLDO4: [4] RK3399_EMMC_ADC_PCIE (C190.2 U8.T23), [18] Power_Management (C324.2 U19.12)
VLDO6: [8] RK3399_SDIO_SPI_GPIOs (C223.2 C230.2 U8.AC8 U8.N23), [18] Power_Management (C326.2 U19.2)
VLDO7: [8] RK3399_SDIO_SPI_GPIOs (5 pins), [18] Power_Management (C316.2 U19.5)
VLDO8: [8] RK3399_SDIO_SPI_GPIOs (8 pins), [17] Voltage_Regulators (R119.1), [18] Power_Management (C327.2 U19.15)
VSOUT1: [11] FlashMemory (7 pins), [6] RK3399_USB2_USIC (6 pins), [8] RK3399_SDIO_SPI_GPIOs (C226.2 U8.J23), [18] Power_Management (C337.2 U19.7)
CPU_B_SLEEP: [8] RK3399_SDIO_SPI_GPIOs (U8.M27), [17] Voltage_Regulators (U16.A1)
DDR0_A0: [9] LPDDR4_SDRAM1 (U1.H2 U1.R2), [2] RK3399_SDRAM (U8.F2)
DDR0_A1: [9] LPDDR4_SDRAM1 (U1.J2 U1.P2), [2] RK3399_SDRAM (U8.F1)
DDR0_A2: [9] LPDDR4_SDRAM1 (U1.H9 U1.R9), [2] RK3399_SDRAM (U8.G1)
DDR0_A4: [9] LPDDR4_SDRAM1 (U1.H11 U1.R11), [2] RK3399_SDRAM (U8.H2)
DDR0_A5: [9] LPDDR4_SDRAM1 (U1.J11 U1.P11), [2] RK3399_SDRAM (U8.H1)
DDR0_CKE0: [9] LPDDR4_SDRAM1 (U1.J4 U1.P4), [2] RK3399_SDRAM (U8.E1)
DDR0_CKE1: [9] LPDDR4_SDRAM1 (U1.J5 U1.P5), [2] RK3399_SDRAM (U8.F5)
DDR0_CLK1_N: [9] LPDDR4_SDRAM1 (U1.P9), [2] RK3399_SDRAM (U8.J5)
DDR0_CLK1_P: [9] LPDDR4_SDRAM1 (U1.P8), [2] RK3399_SDRAM (U8.H5)
DDR0_CLK_N: [9] LPDDR4_SDRAM1 (U1.J9), [2] RK3399_SDRAM (U8.J4)
DDR0_CLK_P: [9] LPDDR4_SDRAM1 (U1.J8), [2] RK3399_SDRAM (U8.H4)
DDR0_CS0N: [9] LPDDR4_SDRAM1 (U1.H4), [2] RK3399_SDRAM (U8.M6)
DDR0_CS1N: [9] LPDDR4_SDRAM1 (U1.H3), [2] RK3399_SDRAM (U8.B1)
DDR0_CS2N: [9] LPDDR4_SDRAM1 (U1.R4), [2] RK3399_SDRAM (U8.M5)
DDR0_CS3N: [9] LPDDR4_SDRAM1 (U1.R3), [2] RK3399_SDRAM (U8.C2)
DDR0_D0: [9] LPDDR4_SDRAM1 (U1.B2), [2] RK3399_SDRAM (U8.AB2)
DDR0_D1: [9] LPDDR4_SDRAM1 (U1.C2), [2] RK3399_SDRAM (U8.AB1)
DDR0_D2: [9] LPDDR4_SDRAM1 (U1.E2), [2] RK3399_SDRAM (U8.AA2)
DDR0_D3: [9] LPDDR4_SDRAM1 (U1.F2), [2] RK3399_SDRAM (U8.AA1)
DDR0_D4: [9] LPDDR4_SDRAM1 (U1.F4), [2] RK3399_SDRAM (U8.Y2)
DDR0_D5: [9] LPDDR4_SDRAM1 (U1.E4), [2] RK3399_SDRAM (U8.Y1)
DDR0_D6: [9] LPDDR4_SDRAM1 (U1.C4), [2] RK3399_SDRAM (U8.W1)
DDR0_D7: [9] LPDDR4_SDRAM1 (U1.B4), [2] RK3399_SDRAM (U8.W2)
DDR0_D8: [9] LPDDR4_SDRAM1 (U1.B11), [2] RK3399_SDRAM (U8.AF2)
DDR0_D9: [9] LPDDR4_SDRAM1 (U1.C11), [2] RK3399_SDRAM (U8.AE2)
DDR0_D10: [9] LPDDR4_SDRAM1 (U1.E11), [2] RK3399_SDRAM (U8.AF1)
DDR0_D11: [9] LPDDR4_SDRAM1 (U1.F11), [2] RK3399_SDRAM (U8.AD2)
DDR0_D12: [9] LPDDR4_SDRAM1 (U1.F9), [2] RK3399_SDRAM (U8.AE1)
DDR0_D13: [9] LPDDR4_SDRAM1 (U1.E9), [2] RK3399_SDRAM (U8.AD1)
DDR0_D14: [9] LPDDR4_SDRAM1 (U1.C9), [2] RK3399_SDRAM (U8.AC1)
DDR0_D15: [9] LPDDR4_SDRAM1 (U1.B9), [2] RK3399_SDRAM (U8.AC2)
DDR0_D16: [9] LPDDR4_SDRAM1 (U1.AA2), [2] RK3399_SDRAM (U8.V1)
DDR0_D18: [9] LPDDR4_SDRAM1 (U1.V2), [2] RK3399_SDRAM (U8.U1)
DDR0_D20: [9] LPDDR4_SDRAM1 (U1.U4), [2] RK3399_SDRAM (U8.T1)
DDR0_D21: [9] LPDDR4_SDRAM1 (U1.V4), [2] RK3399_SDRAM (U8.T2)
DDR0_D22: [9] LPDDR4_SDRAM1 (U1.Y4), [2] RK3399_SDRAM (U8.R2)
DDR0_D23: [9] LPDDR4_SDRAM1 (U1.AA4), [2] RK3399_SDRAM (U8.R1)
DDR0_D24: [9] LPDDR4_SDRAM1 (U1.AA11), [2] RK3399_SDRAM (U8.P1)
DDR0_D25: [9] LPDDR4_SDRAM1 (U1.Y11), [2] RK3399_SDRAM (U8.P2)
DDR0_D26: [9] LPDDR4_SDRAM1 (U1.V11), [2] RK3399_SDRAM (U8.N1)
DDR0_D27: [9] LPDDR4_SDRAM1 (U1.U11), [2] RK3399_SDRAM (U8.M1)
DDR0_D28: [9] LPDDR4_SDRAM1 (U1.U9), [2] RK3399_SDRAM (U8.N2)
DDR0_D29: [9] LPDDR4_SDRAM1 (U1.V9), [2] RK3399_SDRAM (U8.L1)
DDR0_D30: [9] LPDDR4_SDRAM1 (U1.Y9), [2] RK3399_SDRAM (U8.M2)
DDR0_D31: [9] LPDDR4_SDRAM1 (U1.AA9), [2] RK3399_SDRAM (U8.L2)
DDR0_DM0: [9] LPDDR4_SDRAM1 (U1.C3), [2] RK3399_SDRAM (U8.Y5)
DDR0_DM1: [9] LPDDR4_SDRAM1 (U1.C10), [2] RK3399_SDRAM (U8.AC5)
DDR0_DM2: [9] LPDDR4_SDRAM1 (U1.Y3), [2] RK3399_SDRAM (U8.U5)
DDR0_DM3: [9] LPDDR4_SDRAM1 (U1.Y10), [2] RK3399_SDRAM (U8.P5)
DDR0_DQS0_N: [9] LPDDR4_SDRAM1 (U1.E3), [2] RK3399_SDRAM (U8.AA4)
DDR0_DQS0_P: [9] LPDDR4_SDRAM1 (U1.D3), [2] RK3399_SDRAM (U8.Y4)
DDR0_DQS1_N: [9] LPDDR4_SDRAM1 (U1.E10), [2] RK3399_SDRAM (U8.AD4)
DDR0_DQS1_P: [9] LPDDR4_SDRAM1 (U1.D10), [2] RK3399_SDRAM (U8.AC4)
DDR0_DQS2_N: [9] LPDDR4_SDRAM1 (U1.V3), [2] RK3399_SDRAM (U8.V4)
DDR0_DQS2_P: [9] LPDDR4_SDRAM1 (U1.W3), [2] RK3399_SDRAM (U8.U4)
DDR0_DQS3_N: [9] LPDDR4_SDRAM1 (U1.V10), [2] RK3399_SDRAM (U8.R4)
DDR0_DQS3_P: [9] LPDDR4_SDRAM1 (U1.W10), [2] RK3399_SDRAM (U8.P4)
DDR1_A2: [10] LPDDR_SDRAM2 (U2.H9 U2.R9), [2] RK3399_SDRAM (U8.B9)
DDR1_A3: [10] LPDDR_SDRAM2 (U2.H10 U2.R10), [2] RK3399_SDRAM (U8.A9)
DDR1_A4: [10] LPDDR_SDRAM2 (U2.H11 U2.R11), [2] RK3399_SDRAM (U8.B8)
DDR1_A5: [10] LPDDR_SDRAM2 (U2.J11 U2.P11), [2] RK3399_SDRAM (U8.A8)
DDR1_CKE0: [10] LPDDR_SDRAM2 (U2.J4 U2.P4), [2] RK3399_SDRAM (U8.A5)
DDR1_CKE1: [10] LPDDR_SDRAM2 (U2.J5 U2.P5), [2] RK3399_SDRAM (U8.E6)
DDR1_CLK1_N: [10] LPDDR_SDRAM2 (U2.P9), [2] RK3399_SDRAM (U8.E8)
DDR1_CLK1_P: [10] LPDDR_SDRAM2 (U2.P8), [2] RK3399_SDRAM (U8.E9)
DDR1_CLK_N: [10] LPDDR_SDRAM2 (U2.J9), [2] RK3399_SDRAM (U8.D8)
DDR1_CLK_P: [10] LPDDR_SDRAM2 (U2.J8), [2] RK3399_SDRAM (U8.D9)
DDR1_CS0N: [10] LPDDR_SDRAM2 (U2.H4), [2] RK3399_SDRAM (U8.F12)
DDR1_CS1N: [10] LPDDR_SDRAM2 (U2.H3), [2] RK3399_SDRAM (U8.A2)
DDR1_CS2N: [10] LPDDR_SDRAM2 (U2.R4), [2] RK3399_SDRAM (U8.F11)
DDR1_CS3N: [10] LPDDR_SDRAM2 (U2.R3), [2] RK3399_SDRAM (U8.B3)
DDR1_D0: [10] LPDDR_SDRAM2 (U2.B2), [2] RK3399_SDRAM (U8.B15)
DDR1_D1: [10] LPDDR_SDRAM2 (U2.C2), [2] RK3399_SDRAM (U8.A15)
DDR1_D2: [10] LPDDR_SDRAM2 (U2.E2), [2] RK3399_SDRAM (U8.B16)
DDR1_D3: [10] LPDDR_SDRAM2 (U2.F2), [2] RK3399_SDRAM (U8.A16)
DDR1_D4: [10] LPDDR_SDRAM2 (U2.F4), [2] RK3399_SDRAM (U8.B17)
DDR1_D5: [10] LPDDR_SDRAM2 (U2.E4), [2] RK3399_SDRAM (U8.A17)
DDR1_D6: [10] LPDDR_SDRAM2 (U2.C4), [2] RK3399_SDRAM (U8.A18)
DDR1_D7: [10] LPDDR_SDRAM2 (U2.B4), [2] RK3399_SDRAM (U8.B18)
DDR1_D8: [10] LPDDR_SDRAM2 (U2.B11), [2] RK3399_SDRAM (U8.B11)
DDR1_D9: [10] LPDDR_SDRAM2 (U2.C11), [2] RK3399_SDRAM (U8.B12)
DDR1_D10: [10] LPDDR_SDRAM2 (U2.E11), [2] RK3399_SDRAM (U8.A11)
DDR1_D11: [10] LPDDR_SDRAM2 (U2.F11), [2] RK3399_SDRAM (U8.B13)
DDR1_D12: [10] LPDDR_SDRAM2 (U2.F9), [2] RK3399_SDRAM (U8.A12)
DDR1_D13: [10] LPDDR_SDRAM2 (U2.E9), [2] RK3399_SDRAM (U8.A13)
DDR1_D14: [10] LPDDR_SDRAM2 (U2.C9), [2] RK3399_SDRAM (U8.A14)
DDR1_D15: [10] LPDDR_SDRAM2 (U2.B9), [2] RK3399_SDRAM (U8.B14)
DDR1_D18: [10] LPDDR_SDRAM2 (U2.V2), [2] RK3399_SDRAM (U8.A20)
DDR1_D19: [10] LPDDR_SDRAM2 (U2.U2), [2] RK3399_SDRAM (U8.B20)
DDR1_D20: [10] LPDDR_SDRAM2 (U2.U4), [2] RK3399_SDRAM (U8.A21)
DDR1_D21: [10] LPDDR_SDRAM2 (U2.V4), [2] RK3399_SDRAM (U8.B21)
DDR1_D22: [10] LPDDR_SDRAM2 (U2.Y4), [2] RK3399_SDRAM (U8.B22)
DDR1_D23: [10] LPDDR_SDRAM2 (U2.AA4), [2] RK3399_SDRAM (U8.A22)
DDR1_D24: [10] LPDDR_SDRAM2 (U2.AA11), [2] RK3399_SDRAM (U8.A23)
DDR1_D25: [10] LPDDR_SDRAM2 (U2.Y11), [2] RK3399_SDRAM (U8.B23)
DDR1_D26: [10] LPDDR_SDRAM2 (U2.V11), [2] RK3399_SDRAM (U8.A24)
DDR1_D27: [10] LPDDR_SDRAM2 (U2.U11), [2] RK3399_SDRAM (U8.A25)
DDR1_D28: [10] LPDDR_SDRAM2 (U2.U9), [2] RK3399_SDRAM (U8.B24)
DDR1_D29: [10] LPDDR_SDRAM2 (U2.V9), [2] RK3399_SDRAM (U8.A26)
DDR1_D30: [10] LPDDR_SDRAM2 (U2.Y9), [2] RK3399_SDRAM (U8.B25)
DDR1_D31: [10] LPDDR_SDRAM2 (U2.AA9), [2] RK3399_SDRAM (U8.B26)
DDR1_DM0: [10] LPDDR_SDRAM2 (U2.C3), [2] RK3399_SDRAM (U8.E17)
DDR1_DM1: [10] LPDDR_SDRAM2 (U2.C10), [2] RK3399_SDRAM (U8.E14)
DDR1_DM2: [10] LPDDR_SDRAM2 (U2.Y3), [2] RK3399_SDRAM (U8.E20)
DDR1_DM3: [10] LPDDR_SDRAM2 (U2.Y10), [2] RK3399_SDRAM (U8.E23)
DDR1_DQS0_N: [10] LPDDR_SDRAM2 (U2.E3), [2] RK3399_SDRAM (U8.D17)
DDR1_DQS0_P: [10] LPDDR_SDRAM2 (U2.D3), [2] RK3399_SDRAM (U8.D18)
DDR1_DQS1_N: [10] LPDDR_SDRAM2 (U2.E10), [2] RK3399_SDRAM (U8.D14)
DDR1_DQS1_P: [10] LPDDR_SDRAM2 (U2.D10), [2] RK3399_SDRAM (U8.D15)
DDR1_DQS2_N: [10] LPDDR_SDRAM2 (U2.V3), [2] RK3399_SDRAM (U8.D20)
DDR1_DQS2_P: [10] LPDDR_SDRAM2 (U2.W3), [2] RK3399_SDRAM (U8.D21)
DDR1_DQS3_N: [10] LPDDR_SDRAM2 (U2.V10), [2] RK3399_SDRAM (U8.D23)
DDR1_DQS3_P: [10] LPDDR_SDRAM2 (U2.W10), [2] RK3399_SDRAM (U8.D24)
DDR1_RST: [10] LPDDR_SDRAM2 (U2.T11), [2] RK3399_SDRAM (U8.G11)
EDP_TX0_N: [5] RK3399_EDP_CSI_HDMI (C196.2), [19] RAM Memory module (J5.249)
EDP_TX0_P: [5] RK3399_EDP_CSI_HDMI (C195.2), [19] RAM Memory module (J5.251)
EDP_TX1_N: [5] RK3399_EDP_CSI_HDMI (C198.2), [19] RAM Memory module (J5.243)
EDP_TX1_P: [5] RK3399_EDP_CSI_HDMI (C197.2), [19] RAM Memory module (J5.245)
EDP_TX2_N: [5] RK3399_EDP_CSI_HDMI (C200.2), [19] RAM Memory module (J5.237)
EDP_TX2_P: [5] RK3399_EDP_CSI_HDMI (C199.2), [19] RAM Memory module (J5.239)
EDP_TX3_N: [5] RK3399_EDP_CSI_HDMI (C202.2), [19] RAM Memory module (J5.231)
EDP_TX3_P: [5] RK3399_EDP_CSI_HDMI (C201.2), [19] RAM Memory module (J5.233)
EDPAUX_N: [5] RK3399_EDP_CSI_HDMI (U8.A28), [19] RAM Memory module (J5.257)
EDPAUX_P: [5] RK3399_EDP_CSI_HDMI (U8.B28), [19] RAM Memory module (J5.255)
EFUSE_VQPS_EN_H: [3] RK3399_PMU (U9.3), [8] RK3399_SDIO_SPI_GPIOs (U8.AK3)
EMMC_CLKO: [11] FlashMemory (U3.M5), [4] RK3399_EMMC_ADC_PCIE (R25.2)
EMMC_CMD: [11] FlashMemory (U3.M6), [4] RK3399_EMMC_ADC_PCIE (U8.J31)
EMMC_D0: [11] FlashMemory (U3.A3), [4] RK3399_EMMC_ADC_PCIE (U8.J28)
EMMC_D1: [11] FlashMemory (U3.A4), [4] RK3399_EMMC_ADC_PCIE (U8.J29)
EMMC_D2: [11] FlashMemory (U3.A5), [4] RK3399_EMMC_ADC_PCIE (U8.J30)
EMMC_D3: [11] FlashMemory (U3.B2), [4] RK3399_EMMC_ADC_PCIE (U8.J25)
EMMC_D4: [11] FlashMemory (U3.B3), [4] RK3399_EMMC_ADC_PCIE (U8.J26)
EMMC_D5: [11] FlashMemory (U3.B4), [4] RK3399_EMMC_ADC_PCIE (U8.J27)
EMMC_D6: [11] FlashMemory (U3.B5), [4] RK3399_EMMC_ADC_PCIE (U8.L31)
EMMC_D7: [11] FlashMemory (U3.B6), [4] RK3399_EMMC_ADC_PCIE (U8.K30)
EMMC_STRB: [11] FlashMemory (U3.H5), [4] RK3399_EMMC_ADC_PCIE (U8.K31)
GPIO0_B5/LED1_OUT: [3] RK3399_PMU (U8.P24), [15] PushButtons (R93.1)
GPIO1_A2_CC_INT_L: [8] RK3399_SDIO_SPI_GPIOs (U8.R26), [13] TYPEC0_PROG (U10.5)
GPIO1_C4_TP_INT: [8] RK3399_SDIO_SPI_GPIOs (U8.M29), [19] RAM Memory module (J5.84)
GPIO2_B3_CIF_CLKOUTA: [7] RK3399_MIPI-CSI_I2C (U8.H31), [19] RAM Memory module (J5.111)
GPIO4_C1/I2C3_SCL: [8] RK3399_SDIO_SPI_GPIOs (U8.AL2), [19] RAM Memory module (J5.66)
GPIO4_C5/SPDIF_TX: [8] RK3399_SDIO_SPI_GPIOs (U8.AK1), [19] RAM Memory module (J5.50)
GPIO4_C6/PWM1: [8] RK3399_SDIO_SPI_GPIOs (U8.AL3), [19] RAM Memory module (J5.90)
GPIO4_D2: [8] RK3399_SDIO_SPI_GPIOs (U8.AH3), [13] TYPEC0_PROG (B1.4)
GPIO4_D6_LCD_RST_H: [8] RK3399_SDIO_SPI_GPIOs (U8.AG4), [19] RAM Memory module (J5.80)
GPU_SLEEP: [8] RK3399_SDIO_SPI_GPIOs (U8.M25), [17] Voltage_Regulators (U15.A1)
HOST0_D_N: [6] RK3399_USB2_USIC (U8.AB31), [19] RAM Memory module (J5.221)
HOST0_D_P: [6] RK3399_USB2_USIC (U8.AB30), [19] RAM Memory module (J5.219)
HOST1_D_N: [6] RK3399_USB2_USIC (U8.AA31), [19] RAM Memory module (J5.227)
HOST1_D_P: [6] RK3399_USB2_USIC (U8.AA30), [19] RAM Memory module (J5.225)
I2C1_SCL: [8] RK3399_SDIO_SPI_GPIOs (R62.1 U8.Y6), [19] RAM Memory module (J5.53)
I2C1_SDA: [8] RK3399_SDIO_SPI_GPIOs (R61.1 U8.AG1), [19] RAM Memory module (J5.55)
I2C2_SCL: [7] RK3399_MIPI-CSI_I2C (R43.1 U8.H25), [19] RAM Memory module (J5.59)
I2C2_SDA: [7] RK3399_MIPI-CSI_I2C (R42.1 U8.G31), [19] RAM Memory module (J5.57)
I2C4_TPSCL: [8] RK3399_SDIO_SPI_GPIOs (R59.1 U8.P30), [13] TYPEC0_PROG (U10.6), [19] RAM Memory module (J5.70)
I2C4_TPSDA: [8] RK3399_SDIO_SPI_GPIOs (R60.1 U8.P31), [13] TYPEC0_PROG (U10.7), [19] RAM Memory module (J5.72)
I2C7_SCL_HDMI: [7] RK3399_MIPI-CSI_I2C (R45.1 U8.H28), [19] RAM Memory module (J5.61)
I2C7_SDA_HDMI: [7] RK3399_MIPI-CSI_I2C (R44.1 U8.G30), [19] RAM Memory module (J5.63)
I2C_SCL_PMIC: [8] RK3399_SDIO_SPI_GPIOs (R57.1 U8.N30), [17] Voltage_Regulators (U15.A3 U16.A3), [18] Power_Management (U19.19)
I2C_SDA_PMIC: [8] RK3399_SDIO_SPI_GPIOs (R58.1 U8.M26), [17] Voltage_Regulators (U15.B1 U16.B1), [18] Power_Management (U19.18)
I2S0_LRCK_RX: [8] RK3399_SDIO_SPI_GPIOs (U8.AF4), [19] RAM Memory module (J5.69)
I2S0_SCLK: [8] RK3399_SDIO_SPI_GPIOs (U8.AG3), [19] RAM Memory module (J5.67)
I2S0_SDI3SDO1: [8] RK3399_SDIO_SPI_GPIOs (U8.AH2), [19] RAM Memory module (J5.79)
I2S0_SDO0: [8] RK3399_SDIO_SPI_GPIOs (U8.AH1), [19] RAM Memory module (J5.81)
I2S1_LRCK_TX: [8] RK3399_SDIO_SPI_GPIOs (U8.AJ1), [19] RAM Memory module (J5.93)
I2S_CLK: [8] RK3399_SDIO_SPI_GPIOs (U8.AC7), [19] RAM Memory module (J5.85)
LAN_LED0_AD0: [14] Ethernet (R80.1 U11.34), [19] RAM Memory module (J5.232)
LAN_LED0_AD1: [14] Ethernet (R83.2 U11.35), [19] RAM Memory module (J5.234)
LOG_DVS_PWM: [8] RK3399_SDIO_SPI_GPIOs (U8.M28), [17] Voltage_Regulators (R117.1 R119.2)
MAC_COL: [8] RK3399_SDIO_SPI_GPIOs (U8.D27), [14] Ethernet (R84.1 U11.33)
MAC_MCLK: [8] RK3399_SDIO_SPI_GPIOs (R54.2), [14] Ethernet (R74.1)
MAC_RXCLK: [8] RK3399_SDIO_SPI_GPIOs (U8.F25), [14] Ethernet (R76.1)
MAC_RXD0: [8] RK3399_SDIO_SPI_GPIOs (U8.E26), [14] Ethernet (R88.1 U11.14)
MAC_RXD1: [8] RK3399_SDIO_SPI_GPIOs (U8.F27), [14] Ethernet (R81.2 R82.1 U11.16)
MAC_RXD2: [8] RK3399_SDIO_SPI_GPIOs (U8.E30), [14] Ethernet (R89.1 U11.17)
MAC_RXD3: [8] RK3399_SDIO_SPI_GPIOs (U8.E25), [14] Ethernet (R91.1 U11.18)
MAC_RXDV: [8] RK3399_SDIO_SPI_GPIOs (U8.C27), [14] Ethernet (R87.2 U11.13)
MAC_RXER: [8] RK3399_SDIO_SPI_GPIOs (U8.F23), [14] Ethernet (R72.1 U11.20)
MAC_TXCLK: [8] RK3399_SDIO_SPI_GPIOs (R56.2), [14] Ethernet (R79.1)
MAC_TXD0: [8] RK3399_SDIO_SPI_GPIOs (R50.2), [14] Ethernet (U11.23)
MAC_TXD2: [8] RK3399_SDIO_SPI_GPIOs (R46.2), [14] Ethernet (U11.25)
MDI0_N: [14] Ethernet (U11.2), [19] RAM Memory module (J5.256)
MDI0_P: [14] Ethernet (U11.1), [19] RAM Memory module (J5.258)
MDI1_N: [14] Ethernet (U11.5), [19] RAM Memory module (J5.250)
MDI1_P: [14] Ethernet (U11.4), [19] RAM Memory module (J5.252)
MDI2_N: [14] Ethernet (U11.8), [19] RAM Memory module (J5.244)
MDI2_P: [14] Ethernet (U11.7), [19] RAM Memory module (J5.246)
MDI3_N: [14] Ethernet (U11.11), [19] RAM Memory module (J5.238)
MDI3_P: [14] Ethernet (U11.10), [19] RAM Memory module (J5.240)
MIPI_CSI0_PWM: [8] RK3399_SDIO_SPI_GPIOs (U8.AF8), [19] RAM Memory module (J5.101)
MIPI_CSI1_PWN: [3] RK3399_PMU (U8.V26), [19] RAM Memory module (J5.105)
MIPI_CSI1_RST: [3] RK3399_PMU (U8.U28), [19] RAM Memory module (J5.103)
MIPI_RX0_CLK_N: [7] RK3399_MIPI-CSI_I2C (U8.AL13), [19] RAM Memory module (J5.127)
MIPI_RX0_CLK_P: [7] RK3399_MIPI-CSI_I2C (U8.AK13), [19] RAM Memory module (J5.129)
MIPI_RX0_D0_N: [7] RK3399_MIPI-CSI_I2C (U8.AL15), [19] RAM Memory module (J5.139)
MIPI_RX0_D0_P: [7] RK3399_MIPI-CSI_I2C (U8.AK15), [19] RAM Memory module (J5.141)
MIPI_RX0_D1_N: [7] RK3399_MIPI-CSI_I2C (U8.AL14), [19] RAM Memory module (J5.133)
MIPI_RX0_D1_P: [7] RK3399_MIPI-CSI_I2C (U8.AK14), [19] RAM Memory module (J5.135)
MIPI_RX0_D2_N: [7] RK3399_MIPI-CSI_I2C (U8.AL12), [19] RAM Memory module (J5.121)
MIPI_RX0_D2_P: [7] RK3399_MIPI-CSI_I2C (U8.AK12), [19] RAM Memory module (J5.123)
MIPI_RX0_D3_N: [7] RK3399_MIPI-CSI_I2C (U8.AL11), [19] RAM Memory module (J5.115)
MIPI_RX0_D3_P: [7] RK3399_MIPI-CSI_I2C (U8.AK11), [19] RAM Memory module (J5.117)
MIPI_TX1/RX1_CLK_N: [7] RK3399_MIPI-CSI_I2C (U8.AL8), [19] RAM Memory module (J5.128)
MIPI_TX1/RX1_CLK_P: [7] RK3399_MIPI-CSI_I2C (U8.AK8), [19] RAM Memory module (J5.130)
MIPI_TX1/RX1_D0_N: [7] RK3399_MIPI-CSI_I2C (U8.AL6), [19] RAM Memory module (J5.116)
MIPI_TX1/RX1_D0_P: [7] RK3399_MIPI-CSI_I2C (U8.AK6), [19] RAM Memory module (J5.118)
MIPI_TX1/RX1_D2_N: [7] RK3399_MIPI-CSI_I2C (U8.AL9), [19] RAM Memory module (J5.134)
MIPI_TX1/RX1_D2_P: [7] RK3399_MIPI-CSI_I2C (U8.AK9), [19] RAM Memory module (J5.136)
MIPI_TX1/RX1_D3_N: [7] RK3399_MIPI-CSI_I2C (U8.AL10), [19] RAM Memory module (J5.140)
MIPI_TX1/RX1_D3_P: [7] RK3399_MIPI-CSI_I2C (U8.AK10), [19] RAM Memory module (J5.142)
OTP_OUT_H: [8] RK3399_SDIO_SPI_GPIOs (U8.P26), [17] Voltage_Regulators (R113.1)
PCIE_REF_CLK_N: [4] RK3399_EMMC_ADC_PCIE (U8.AD30), [19] RAM Memory module (J5.226)
PCIE_REF_CLK_P: [4] RK3399_EMMC_ADC_PCIE (U8.AD31), [19] RAM Memory module (J5.228)
PCIE_RX0_N: [4] RK3399_EMMC_ADC_PCIE (U8.AF31), [19] RAM Memory module (J5.214)
PCIE_RX0_P: [4] RK3399_EMMC_ADC_PCIE (U8.AF30), [19] RAM Memory module (J5.216)
PCIE_RX1_N: [4] RK3399_EMMC_ADC_PCIE (U8.AH31), [19] RAM Memory module (J5.202)
PCIE_RX1_P: [4] RK3399_EMMC_ADC_PCIE (U8.AH30), [19] RAM Memory module (J5.204)
PCIE_RX2_N: [4] RK3399_EMMC_ADC_PCIE (U8.AC28), [19] RAM Memory module (J5.190)
PCIE_RX2_P: [4] RK3399_EMMC_ADC_PCIE (U8.AC27), [19] RAM Memory module (J5.192)
PCIE_RX3_N: [4] RK3399_EMMC_ADC_PCIE (U8.AF28), [19] RAM Memory module (J5.178)
PCIE_RX3_P: [4] RK3399_EMMC_ADC_PCIE (U8.AF27), [19] RAM Memory module (J5.180)
PCIE_TX0_N: [4] RK3399_EMMC_ADC_PCIE (U8.AE31), [19] RAM Memory module (J5.220)
PCIE_TX0_P: [4] RK3399_EMMC_ADC_PCIE (U8.AE30), [19] RAM Memory module (J5.222)
PCIE_TX1_N: [4] RK3399_EMMC_ADC_PCIE (U8.AG31), [19] RAM Memory module (J5.208)
PCIE_TX1_P: [4] RK3399_EMMC_ADC_PCIE (U8.AG30), [19] RAM Memory module (J5.210)
PCIE_TX2_N: [4] RK3399_EMMC_ADC_PCIE (U8.AA28), [19] RAM Memory module (J5.196)
PCIE_TX2_P: [4] RK3399_EMMC_ADC_PCIE (U8.AA27), [19] RAM Memory module (J5.198)
PCIE_TX3_N: [4] RK3399_EMMC_ADC_PCIE (U8.AD28), [19] RAM Memory module (J5.184)
PCIE_TX3_P: [4] RK3399_EMMC_ADC_PCIE (U8.AD27), [19] RAM Memory module (J5.186)
PMIC_EXT_EN: [16] SPI_TYPEC_PWR (R100.1 U12.8), [17] Voltage_Regulators (U18.2), [18] Power_Management (U19.55)
PMIC_INT_L: [8] RK3399_SDIO_SPI_GPIOs (U8.M30), [18] Power_Management (C344.2 U19.49)
PMIC_SLEEP_H: [8] RK3399_SDIO_SPI_GPIOs (U8.R30), [18] Power_Management (C345.2 Q6.1 U19.50)
PWM0_BL: [8] RK3399_SDIO_SPI_GPIOs (U8.AF5), [19] RAM Memory module (J5.88)
PWR_KEY: [15] PushButtons (SW3.2), [18] Power_Management (R128.1)
PWR_KEY_L: [3] RK3399_PMU (U8.V27), [18] Power_Management (D6.A)
RECOVERY: [4] RK3399_EMMC_ADC_PCIE (R27.2), [15] PushButtons (SW2.2)
RESET_IN_H: [15] PushButtons (SW1.2), [17] Voltage_Regulators (Q3.3), [18] Power_Management (C346.2 U19.6)
RespWROM: [3] RK3399_PMU (R22.1), [18] Power_Management (R124.1 U19.20)
RTC_CLKO_SOC: [3] RK3399_PMU (U8.U31), [18] Power_Management (R126.1 U19.68)
SDIO0_CLK: [8] RK3399_SDIO_SPI_GPIOs (U8.AF7), [19] RAM Memory module (J5.112)
SDIO0_CMD: [8] RK3399_SDIO_SPI_GPIOs (U8.AH6), [19] RAM Memory module (J5.106)
SDIO0_D0: [8] RK3399_SDIO_SPI_GPIOs (U8.AD8), [19] RAM Memory module (J5.98)
SDIO0_D1: [8] RK3399_SDIO_SPI_GPIOs (U8.AK5), [19] RAM Memory module (J5.100)
SDIO0_D2: [8] RK3399_SDIO_SPI_GPIOs (U8.AG7), [19] RAM Memory module (J5.102)
SDIO0_D3: [8] RK3399_SDIO_SPI_GPIOs (U8.AE8), [19] RAM Memory module (J5.104)
SDIO0_DETN: [8] RK3399_SDIO_SPI_GPIOs (U8.AL4), [19] RAM Memory module (J5.108)
SDMMC0_CLK: [12] WIFI_Module (U6.E1), [4] RK3399_EMMC_ADC_PCIE (R24.2)
SDMMC0_CMD: [12] WIFI_Module (U6.A2), [4] RK3399_EMMC_ADC_PCIE (U8.V25)
SDMMC0_D0: [12] WIFI_Module (U6.A1), [4] RK3399_EMMC_ADC_PCIE (U8.Y27)
SDMMC0_D1: [12] WIFI_Module (U6.B2), [4] RK3399_EMMC_ADC_PCIE (U8.Y26)
SDMMC0_D2: [12] WIFI_Module (U6.B1), [4] RK3399_EMMC_ADC_PCIE (U8.Y28)
SDMMC0_DET_L: [12] WIFI_Module (R18.1), [3] RK3399_PMU (U8.V28)
SPI1_CLK: [8] RK3399_SDIO_SPI_GPIOs (U8.P28), [19] RAM Memory module (J5.62)
TYPEC0_D_N: [6] RK3399_USB2_USIC (U8.AH23), [13] TYPEC0_PROG (J3.A7 J3.B7)
TYPEC0_D_P: [6] RK3399_USB2_USIC (U8.AG23), [13] TYPEC0_PROG (J3.A6 J3.B6)
TYPEC0_RX1_N: [6] RK3399_USB2_USIC (U8.AL21), [13] TYPEC0_PROG (J3.B10)
TYPEC0_RX1_P: [6] RK3399_USB2_USIC (U8.AK21), [13] TYPEC0_PROG (J3.B11)
TYPEC0_RX2_N: [6] RK3399_USB2_USIC (U8.AL23), [13] TYPEC0_PROG (J3.A10)
TYPEC0_RX2_P: [6] RK3399_USB2_USIC (U8.AK23), [13] TYPEC0_PROG (J3.A11)
TYPEC0_SBU1_DC_N: [6] RK3399_USB2_USIC (U8.AG17), [13] TYPEC0_PROG (R67.1)
TYPEC0_SBU1_N: [6] RK3399_USB2_USIC (U8.AL20), [13] TYPEC0_PROG (C244.1)
TYPEC0_TX1_N: [6] RK3399_USB2_USIC (U8.AK22), [13] TYPEC0_PROG (C237.1)
TYPEC0_TX1_P: [6] RK3399_USB2_USIC (U8.AL22), [13] TYPEC0_PROG (C238.1)
TYPEC0_TX2_N: [6] RK3399_USB2_USIC (U8.AK24), [13] TYPEC0_PROG (C239.1)
TYPEC0_TX2_P: [6] RK3399_USB2_USIC (U8.AL24), [13] TYPEC0_PROG (C240.1)
TYPEC0_U2VBUSDET: [6] RK3399_USB2_USIC (R36.2), [13] TYPEC0_PROG (D4.K R63.1)
TYPEC1_D_N: [6] RK3399_USB2_USIC (U8.AH24), [19] RAM Memory module (J5.177)
TYPEC1_D_P: [6] RK3399_USB2_USIC (U8.AG24), [19] RAM Memory module (J5.175)
TYPEC1_RX1_N: [6] RK3399_USB2_USIC (U8.AL25), [19] RAM Memory module (J5.189)
TYPEC1_RX1_P: [6] RK3399_USB2_USIC (U8.AK25), [19] RAM Memory module (J5.187)
TYPEC1_RX2_N: [6] RK3399_USB2_USIC (U8.AL27), [19] RAM Memory module (J5.201)
TYPEC1_RX2_P: [6] RK3399_USB2_USIC (U8.AK27), [19] RAM Memory module (J5.199)
TYPEC1_SBU1_DC: [6] RK3399_USB2_USIC (U8.AE24), [19] RAM Memory module (J5.211)
TYPEC1_SBU2_DC: [6] RK3399_USB2_USIC (U8.AF25), [19] RAM Memory module (J5.213)
TYPEC1_TX1_N: [6] RK3399_USB2_USIC (U8.AK26), [19] RAM Memory module (J5.183)
TYPEC1_TX1_P: [6] RK3399_USB2_USIC (U8.AL26), [19] RAM Memory module (J5.181)
TYPEC1_TX2_N: [6] RK3399_USB2_USIC (U8.AK28), [19] RAM Memory module (J5.195)
TYPEC1_TX2_P: [6] RK3399_USB2_USIC (U8.AL28), [19] RAM Memory module (J5.193)
TYPEC1_U2VBUSDET: [6] RK3399_USB2_USIC (R38.2), [19] RAM Memory module (J5.215)
UART2DBG_RX: [8] RK3399_SDIO_SPI_GPIOs (U8.AK2), [19] RAM Memory module (J5.54)